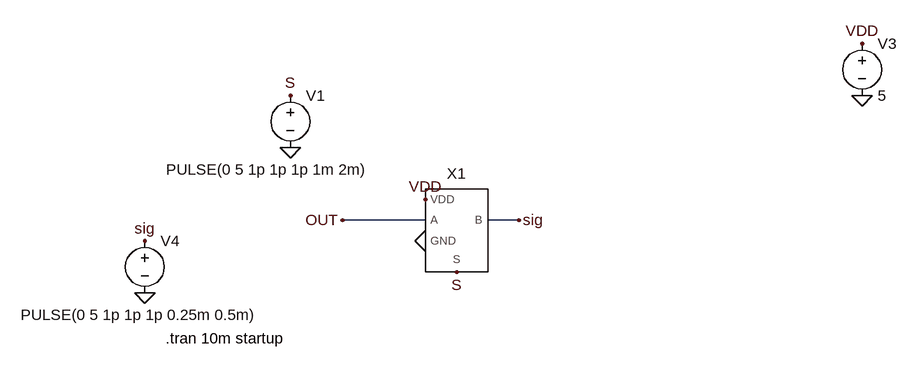
[diagram p0: schematic Draft1.asc]
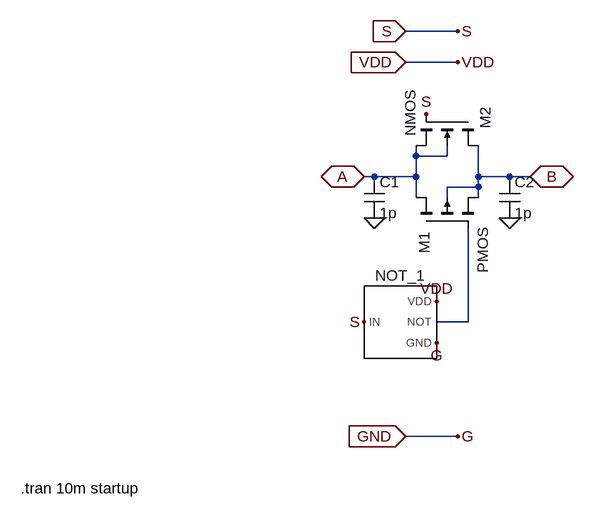
[diagram p1: sub-circuit passgate.asc]
Draft1.asc, the LTspice schematic file:
Version 4
SHEET 1 924 680
WIRE 192 160 64 160
WIRE 336 160 288 160
FLAG -16 -32 S
FLAG -16 48 0
FLAG 864 -32 0
FLAG 864 -112 VDD
FLAG 240 240 S
FLAG 192 128 VDD
FLAG 192 192 0
FLAG -240 272 0
FLAG -240 192 sig
FLAG 64 160 OUT
FLAG 336 160 sig
SYMBOL passgate 240 160 R0
SYMATTR InstName X1
SYMBOL voltage -16 -48 R0
WINDOW 3 -191 130 Left 2
WINDOW 123 0 0 Left 0
WINDOW 39 0 0 Left 0
SYMATTR InstName V1
SYMATTR Value PULSE(0 5 1p 1p 1p 1m 2m)
SYMBOL voltage 864 -128 R0
WINDOW 123 0 0 Left 0
WINDOW 39 0 0 Left 0
SYMATTR InstName V3
SYMATTR Value 5
SYMBOL voltage -240 176 R0
WINDOW 3 -191 130 Left 2
WINDOW 123 0 0 Left 0
WINDOW 39 0 0 Left 0
SYMATTR InstName V4
SYMATTR Value PULSE(0 5 1p 1p 1p 0.25m 0.5m)
TEXT -208 342 Left 2 !.tran 10m startup

passgate.asc, the sub-circuit schematic file:
Version 4
SHEET 1 880 688
WIRE 192 -32 112 -32
WIRE 192 16 112 16
WIRE 128 160 128 144
WIRE 176 160 176 144
WIRE 176 160 128 160
WIRE 64 192 48 192
WIRE 128 192 128 160
WIRE 128 192 64 192
WIRE 224 192 224 144
WIRE 272 192 224 192
WIRE 304 192 272 192
WIRE 224 208 224 192
WIRE 224 208 176 208
WIRE 128 224 128 192
WIRE 176 224 176 208
WIRE 224 224 224 208
WIRE 208 416 208 272
WIRE 208 416 160 416
WIRE 192 592 112 592
FLAG 112 -32 S
IOPIN 112 -32 In
FLAG 192 -32 S
FLAG 144 96 S
FLAG 48 416 S
FLAG 112 16 VDD
IOPIN 112 16 In
FLAG 192 16 VDD
FLAG 160 384 VDD
FLAG 112 592 GND
IOPIN 112 592 In
FLAG 192 592 G
FLAG 160 448 G
FLAG 48 192 A
IOPIN 48 192 BiDir
FLAG 304 192 B
IOPIN 304 192 BiDir
FLAG 64 256 0
FLAG 272 256 0
SYMBOL pmos4 128 272 R270
WINDOW 0 -39 13 Left 2
WINDOW 3 -69 103 Left 2
SYMATTR InstName M1
SYMBOL nmos4 224 96 R90
WINDOW 0 -11 -11 Left 2
WINDOW 3 -38 105 Left 2
SYMATTR InstName M2
SYMBOL not 96 416 R0
SYMATTR InstName NOT_1
SYMBOL cap 48 192 R0
SYMATTR InstName C1
SYMATTR Value 1p
SYMBOL cap 256 192 R0
SYMATTR InstName C2
SYMATTR Value 1p
TEXT -480 672 Left 2 !.tran 10m startup

The netlist it stands for:
* Draft1.asc
XX1 0 S VDD OUT sig passgate
V1 S 0 PULSE(0 5 1p 1p 1p 1m 2m)
V3 VDD 0 5
V4 sig 0 PULSE(0 5 1p 1p 1p 0.25m 0.5m)

* block symbol definitions
.subckt passgate GND S VDD A B
M1 A N001 B B PMOS
M2 B S A A NMOS
XNOT_1 S GND N001 VDD not  ; pins IN GND NOT VDD
C1 A 0 1p
C2 B 0 1p
.tran 10m startup
.ends passgate

.model NMOS NMOS
.model PMOS PMOS
.lib standard.mos
.tran 10m startup
.backanno
.end